# EasyEDA schematic SCH_TerrariumMonitor_2025-09-21.json
TITLE: Terrarium Monitor; REV: 1.0; Date: 2025-09-01; Sheet: 1/1; Drawn By: Gustavo N. Santiago; Company: ARA - Digital Ag
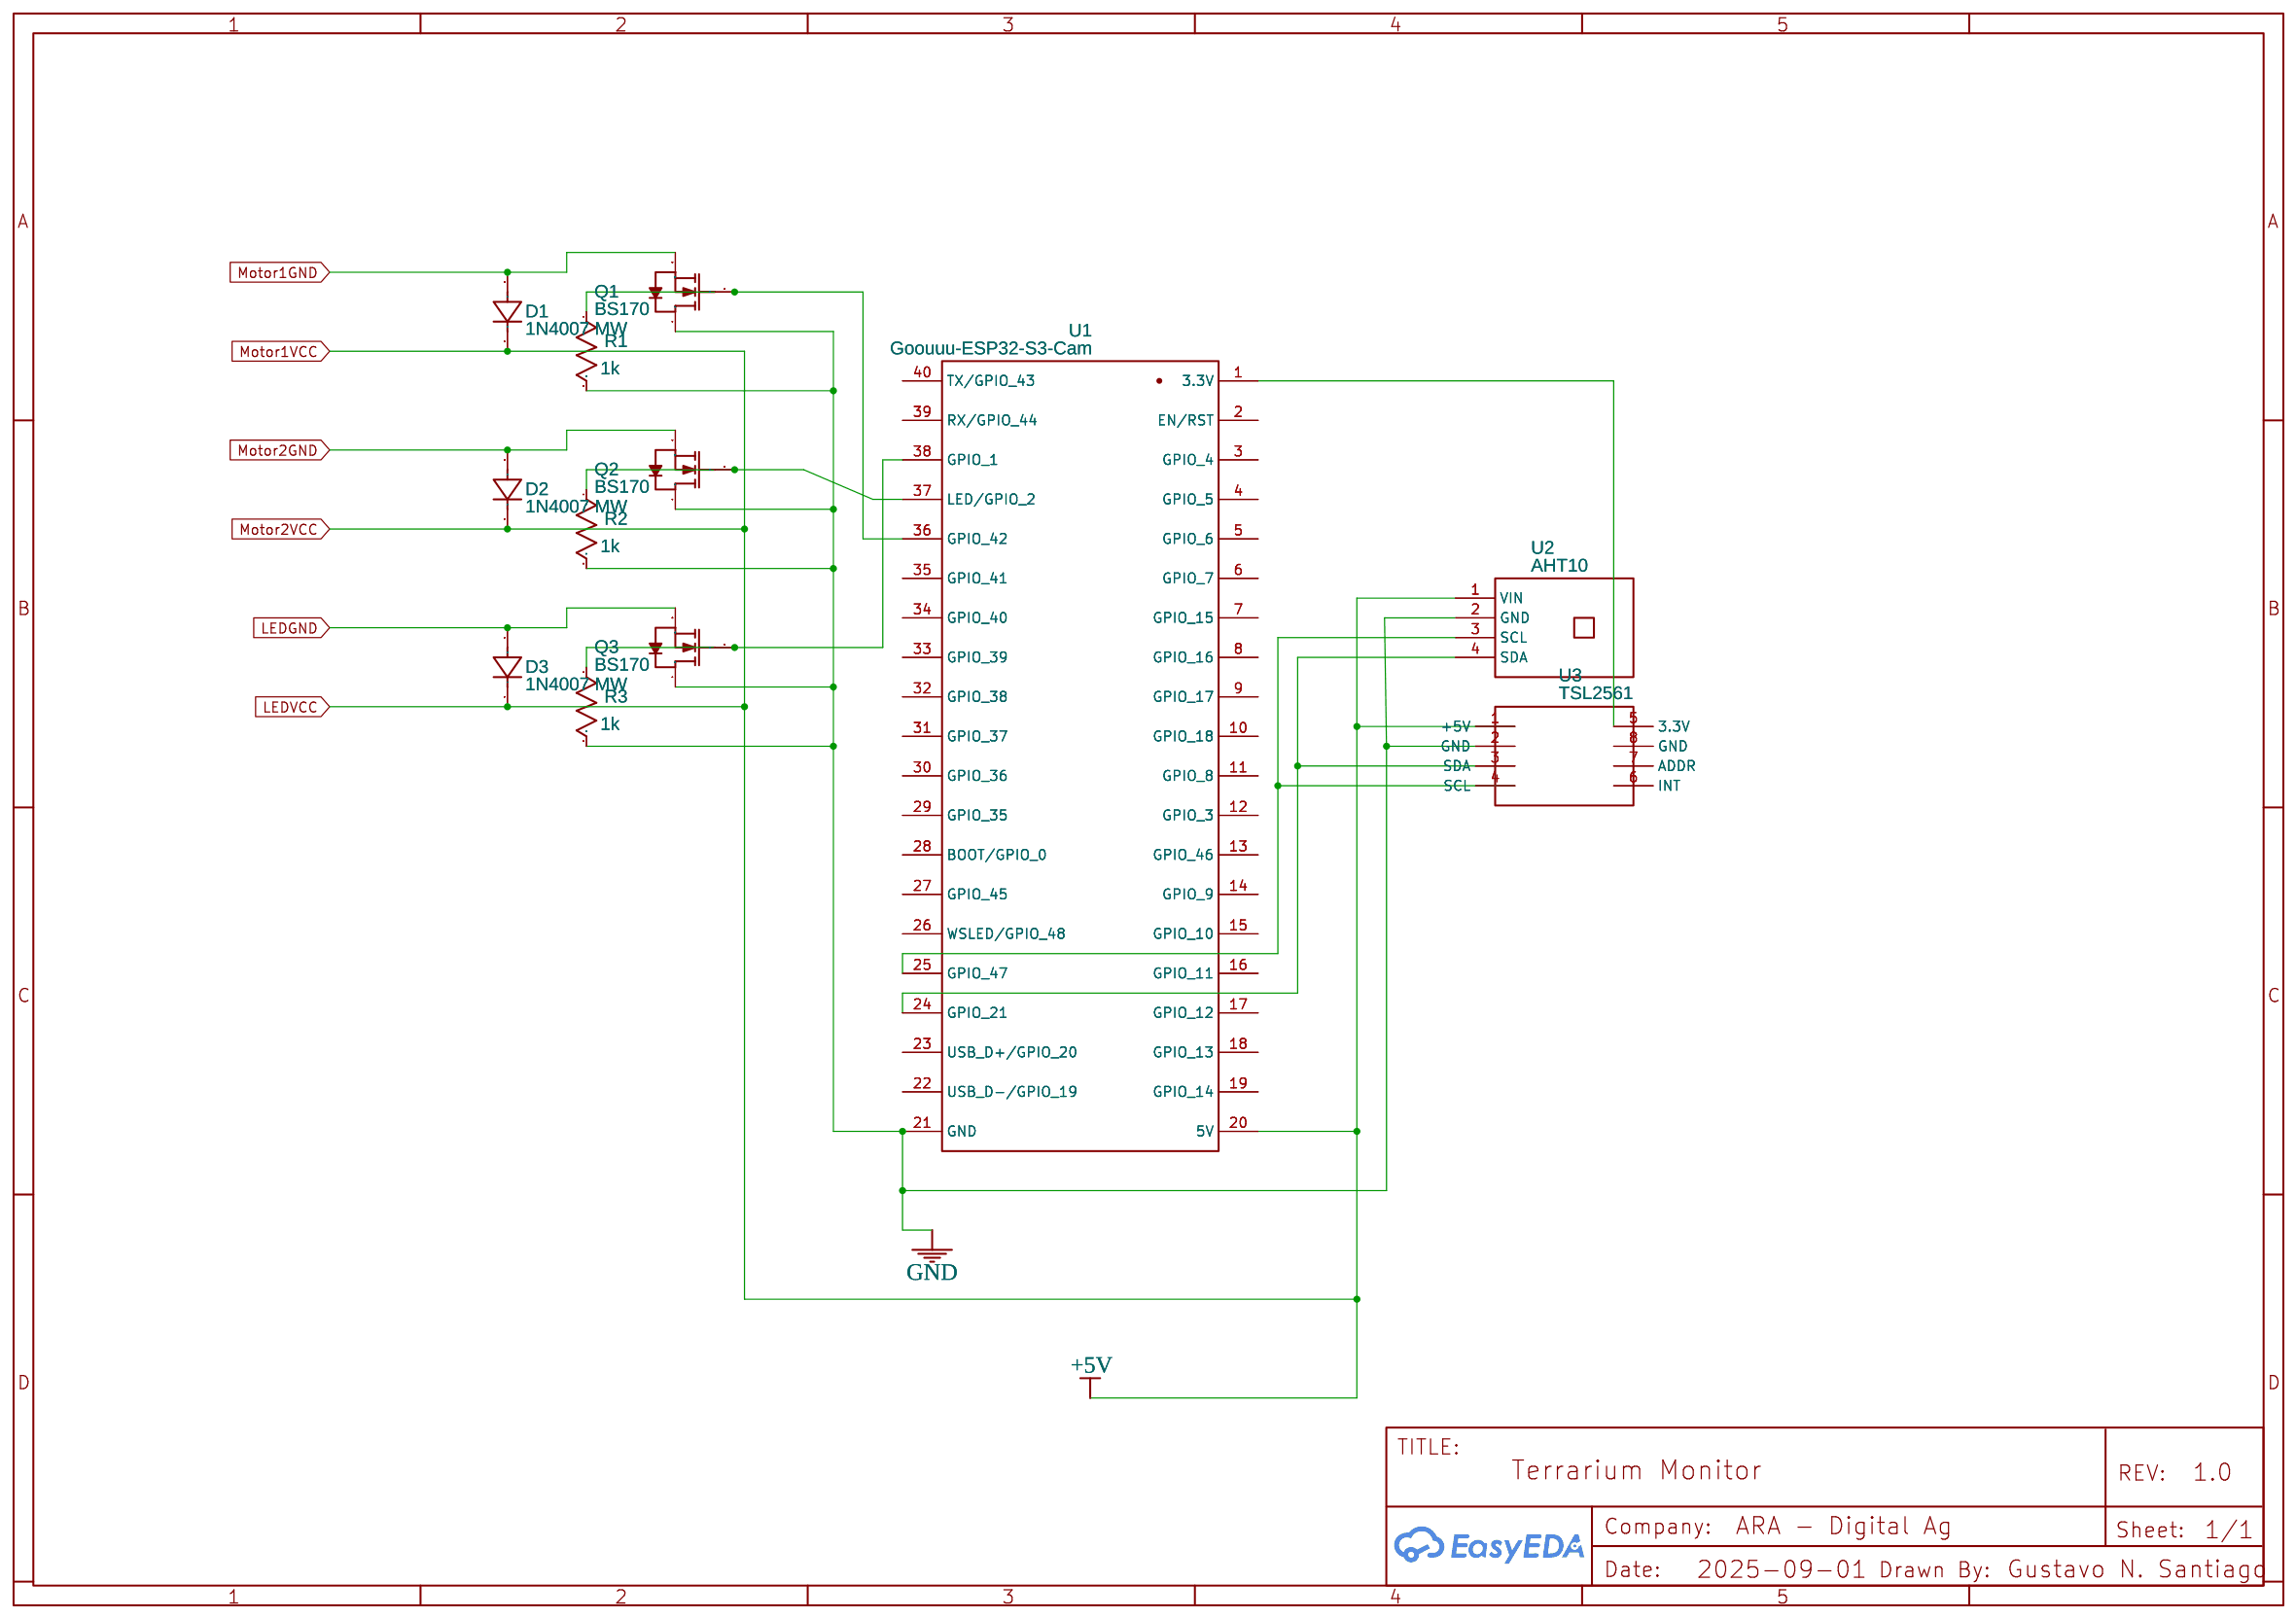
[diagram p0: schematic sheet]

## Parts
D1  1N4007 MW  [DO-41_BD2.4-L4.7-P8.70-D0.8-RD]
D2  1N4007 MW  [DO-41_BD2.4-L4.7-P8.70-D0.8-RD]
D3  1N4007 MW  [DO-41_BD2.4-L4.7-P8.70-D0.8-RD]
Q1  BS170  [TO-92-3_L4.9-W3.7-P1.27-L]
Q2  BS170  [TO-92-3_L4.9-W3.7-P1.27-L]
Q3  BS170  [TO-92-3_L4.9-W3.7-P1.27-L]
R1  1k  [R0603]
R2  1k  [R0603]
R3  1k  [R0603]
U1  Goouuu-ESP32-S3-Cam  [GOOUUU-ESP32-S3-CAM]
U2  AHT10  [AHT10]
U3  TSL2561  [TSL2561]

## Library data of the parts
D1-D3 = 1N4007 MW: Supplier: LCSC; Supplier Part: C42429525; Manufacturer: YFW(佑风微); Contributor: lcsc; JLCPCB Part Class: Extended Part
Q1-Q3 = BS170: Supplier: LCSC; Manufacturer: onsemi(安森美); Supplier Part: C111691; JLCPCB Part Class: Extended Part
R1-R3 = R_0603_US: Contributor: LCEDA_Lib
U1 = Goouuu-ESP32-S3-Cam: Manufacturer: Freenove; Manufacturer Part: FreenoveESP-S3 WROOM; link: https://github.com/Freenove/Freenove_ESP32_S3_WROOM_Board; Contributor: Richard S
U2 = AHT10: Contributor: modlfo
U3 = TSL2561: Contributor: gutim1998

## Nets
+5V: D1.1(K) D2.1(K) D3.1(K) U1.20(5V) U2.1(VIN) U3.1(+5V)
GND: Q1.1(D) Q2.1(D) Q3.1(D) R1.2 R2.2 R3.2 U1.21(GND) U2.2(GND) U3.2(GND)
LEDGND: D3.2(A) Q3.3(S)
Motor1GND: D1.2(A) Q1.3(S)
Motor2GND: D2.2(A) Q2.3(S)
Net-(Q1-2): Q1.2(G) R1.1 U1.36(GPIO_42)
Net-(Q2-2): Q2.2(G) R2.1 U1.37(LED/GPIO_2)
Net-(Q3-2): Q3.2(G) R3.1 U1.38(GPIO_1)
Net-(U1-1): U1.1(3.3V) U3.5(3.3V)
Net-(U1-24): U1.24(GPIO_21) U2.4(SDA) U3.3(SDA)
Net-(U1-25): U1.25(GPIO_47) U2.3(SCL) U3.4(SCL)

Not connected (* = marked no-connect by the designer): U1 2(EN/RST) 3(GPIO_4) 4(GPIO_5) 5(GPIO_6) 6(GPIO_7) 7(GPIO_15) 8(GPIO_16) 9(GPIO_17) 10(GPIO_18) 11(GPIO_8) 12(GPIO_3) 13(GPIO_46) 14(GPIO_9) 15(GPIO_10) 16(GPIO_11) 17(GPIO_12) 18(GPIO_13) 19(GPIO_14) 22(USB D-/GPIO_19) 23(USB D+/GPIO_20) 26(WSLED/GPIO_48) 27(GPIO_45) 28(BOOT/GPIO_0) 29(GPIO_35) 30(GPIO_36) 31(GPIO_37) 32(GPIO_38) 33(GPIO_39) 34(GPIO_40) 35(GPIO_41) 39(RX/GPIO_44) 40(TX/GPIO_43); U3 6(INT) 7(ADDR) 8(GND)
